# Altium schematic sheet Key.SchDoc
size A
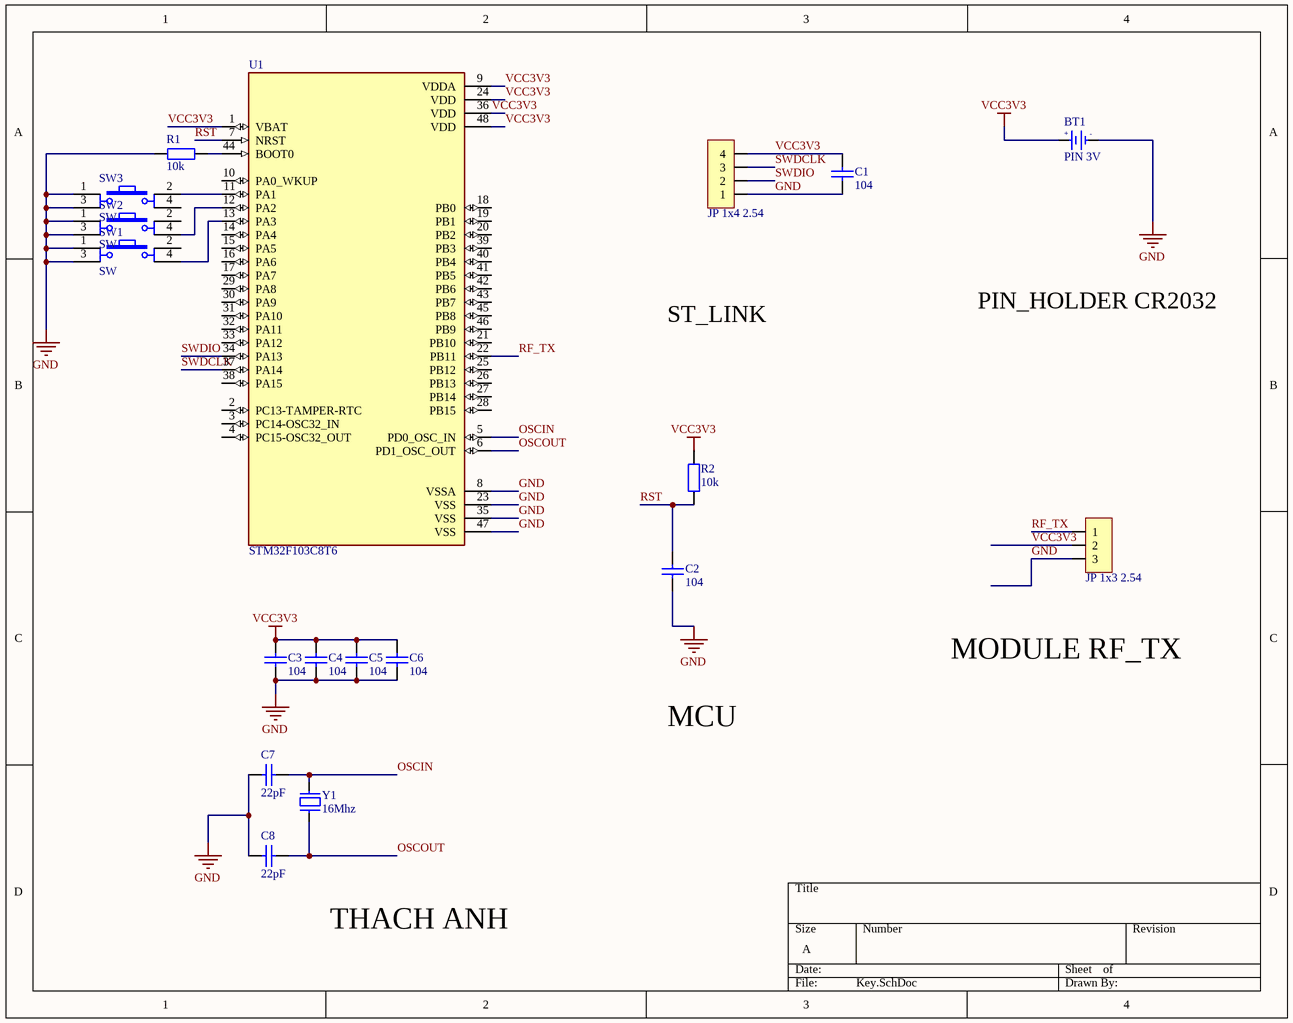
[diagram p0: Key.SchDoc]

## Parts
BT1  PIN 3V  [PIN3V]
C1  104  [tu 0805]
C2  104  [tu 0805]
C3  104  [tu 0805]
C4  104  [tu 0805]
C5  104  [tu 0805]
C6  104  [tu 0805]
C7  22pF  [tu 0805]
C8  22pF  [tu 0805]
JP1  JP 1x4 2.54  [JP 1x4 DT]
JP2  JP 1x3 2.54  [JP 1x3 CT]
R1  10k  [tro smd 0603]
R2  10k  [tro smd 0603]
SW1  SW  [SW4]
SW2  SW  [SW4]
SW3  SW  [SW4]
U1  STM32F103C8T6  [QFP50P900X900X160-48N]
Y1  16Mhz  [Thach Anh 2 chan cam]

## Nets
GND: BT1.2(GND) C1.2 C2.2 C3.2 C4.2 C5.2 C6.2 C7.2 C8.2 JP1.1 JP2.3 R1.2 SW1.1 SW1.3 SW2.1 SW2.3 SW3.1 SW3.3 U1.8(VSSA) U1.23(VSS) U1.35(VSS) U1.47(VSS)
VCC3V3: BT1.1(+3V) C1.1 C3.1 C4.1 C5.1 C6.1 JP1.4 JP2.2 R2.2 U1.1(VBAT) U1.9(VDDA) U1.24(VDD) U1.36(VDD) U1.48(VDD)
OSCIN: C7.1 U1.5(PD0_OSC_IN) Y1.2
OSCOUT: C8.1 U1.6(PD1_OSC_OUT) Y1.1
RF_TX: JP2.1 U1.22(PB11)
RST: C2.1 R2.1 U1.7(NRST)
SWDCLK: JP1.3 U1.37(PA14)
SWDIO: JP1.2 U1.34(PA13)
NetR1_1: R1.1 U1.44(BOOT0)
NetSW1_4: SW1.4 U1.13(PA3)
NetSW2_4: SW2.4 U1.12(PA2)
NetSW3_2: SW3.2 U1.11(PA1)

Not connected (* = marked no-connect by the designer): SW1 2; SW2 2; SW3 4; U1 2(PC13-TAMPER-RTC) 3(PC14-OSC32_IN) 4(PC15-OSC32_OUT) 10(PA0_WKUP) 14(PA4) 15(PA5) 16(PA6) 17(PA7) 18(PB0) 19(PB1) 20(PB2) 21(PB10) 25(PB12) 26(PB13) 27(PB14) 28(PB15) 29(PA8) 30(PA9) 31(PA10) 32(PA11) 33(PA12) 38(PA15) 39(PB3) 40(PB4) 41(PB5) 42(PB6) 43(PB7) 45(PB8) 46(PB9)

## Notes on the sheet
- ST_LINK
- PIN_HOLDER CR2032
- MODULE RF_TX
- MCU
- THACH ANH
- (in symbol PIN 3V) +; -

## Library data of the parts
BT1 = PIN 3V: Battery 3VDC; Value: PIN 3V
C1-C6 = Tu 0805 104 50V 10%: Dán; Don_Vi: Con; So_Chan: 2; Ten_Linh_Kien: Tụ 0805 104-100nF 10% 50V; Ma_Hang: MH004551; Chung_Loai: Dán; Kieu_Chan: *
C7 C8 = Tu 0805 22pF 50V 10%: Dán; Don_Vi: Con; So_Chan: 2; Ten_Linh_Kien: Tụ 0805 22P 10% 50V; Ma_Hang: MH004560; Chung_Loai: Dán; Kieu_Chan: *
JP1 = JP 1x4 2.54 Duc Thang: Cắm; Ten_Linh_Kien: Jump Đơn Đực 2.54MM 1x40P Thẳng 11MM; Don_Vi: Con; Ma_Hang: MH000903; Ghi_Chu: *; Kieu_Chan: *; Chung_Loai: Cắm
JP2 = JP 1x3 2.54 Cai Thang: Cắm; Ten_Linh_Kien: Jump Đơn Cái 2.54MM 1x20P Thẳng; Don_Vi: Con; Ma_Hang: MH004006; Ghi_Chu: *; Kieu_Chan: *; Chung_Loai: Cắm
R1 R2 = Tro 0603 5% 10k: Dán; Don_Vi: Con; So_Chan: 2; Ten_Linh_Kien: Trở 0603 5% 10k; Ma_Hang: MH006316; Chung_Loai: Dán; Kieu_Chan: *
SW1-SW3 = SW4: Switch button 4 pin; Value: Button chip 4 pin
U1 = STM32F103C8T6: ARMÂ® CortexÂ®-M3 STM32F1 Microcontroller IC 32-Bit 72MHz 64KB _64K x 8_ FLASH; MF: STMicroelectronics; Price: None; Package: LQFP-48 STMicroelectronics; Value: *; MP: STM32F103C8T6; Availability: Unavailable; SnapEDA_Link: https://www.snapeda.com/parts/STM32F103C8T6/STMicroelectronics/view-part/52195/?ref=snap
Y1 = Thach Anh 2 chan Cam: Crystal For all Crystal 2pin.; Value: 4Mhz